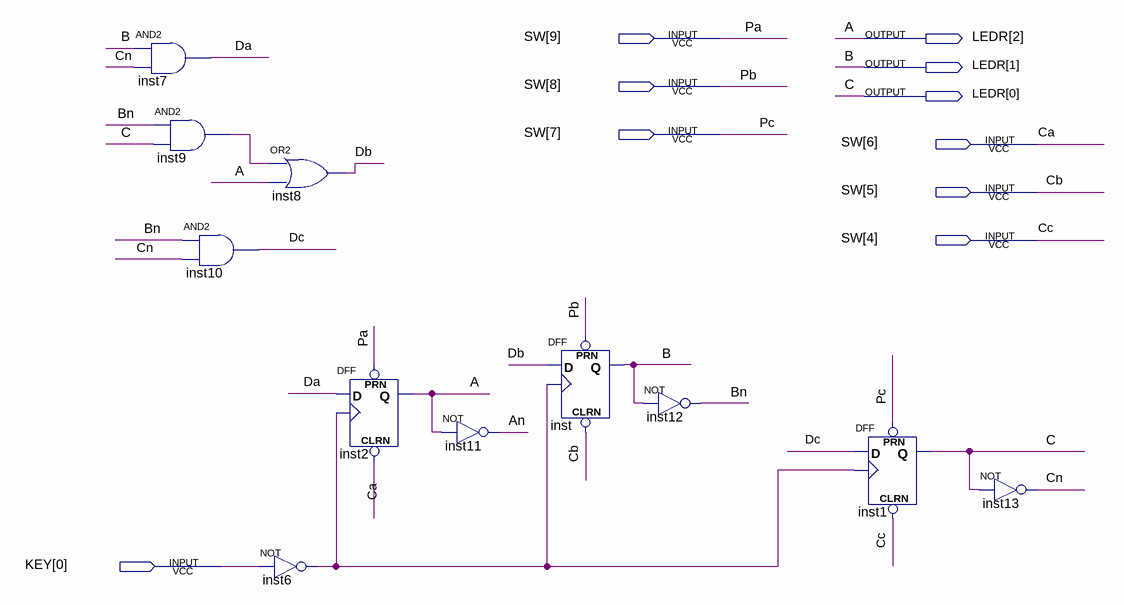
[diagram p0: schematic sheet]
// Quartus schematic Counter.bdf as structural Verilog: 11 symbols, 10 pins
module Counter (
  input  [9:4] SW,
  input  [0:0] KEY,
  output [2:0] LEDR
);

  wire An, Bn, Cn, Da, Db, Dc, inst6_out, inst9_out;

  and inst7 (Da, LEDR[1], Cn);
  and inst9 (inst9_out, Bn, LEDR[0]);
  and inst10 (Dc, Bn, Cn);
  not inst6 (inst6_out, KEY[0]);
  or inst8 (Db, inst9_out, LEDR[2]);
  DFF inst2 (.CLRN(SW[6]), .CLK(inst6_out), .D(Da), .PRN(SW[9]), .Q(LEDR[2]));
  not inst11 (An, LEDR[2]);
  DFF inst (.CLRN(SW[5]), .CLK(inst6_out), .D(Db), .PRN(SW[8]), .Q(LEDR[1]));
  not inst12 (Bn, LEDR[1]);
  DFF inst1 (.CLRN(SW[4]), .CLK(inst6_out), .D(Dc), .PRN(SW[7]), .Q(LEDR[0]));
  not inst13 (Cn, LEDR[0]);

  // Other names for the same wires on the sheet: A = LEDR[2]; B = LEDR[1]; C = LEDR[0]; Ca = SW[6]; Cb = SW[5];
  //   Cc = SW[4]; Pa = SW[9]; Pb = SW[8]; Pc = SW[7]
endmodule
